# EAGLE design LoRa ST v2.0 (EAGLE 7.5.0)

## Sheet 1 of 2
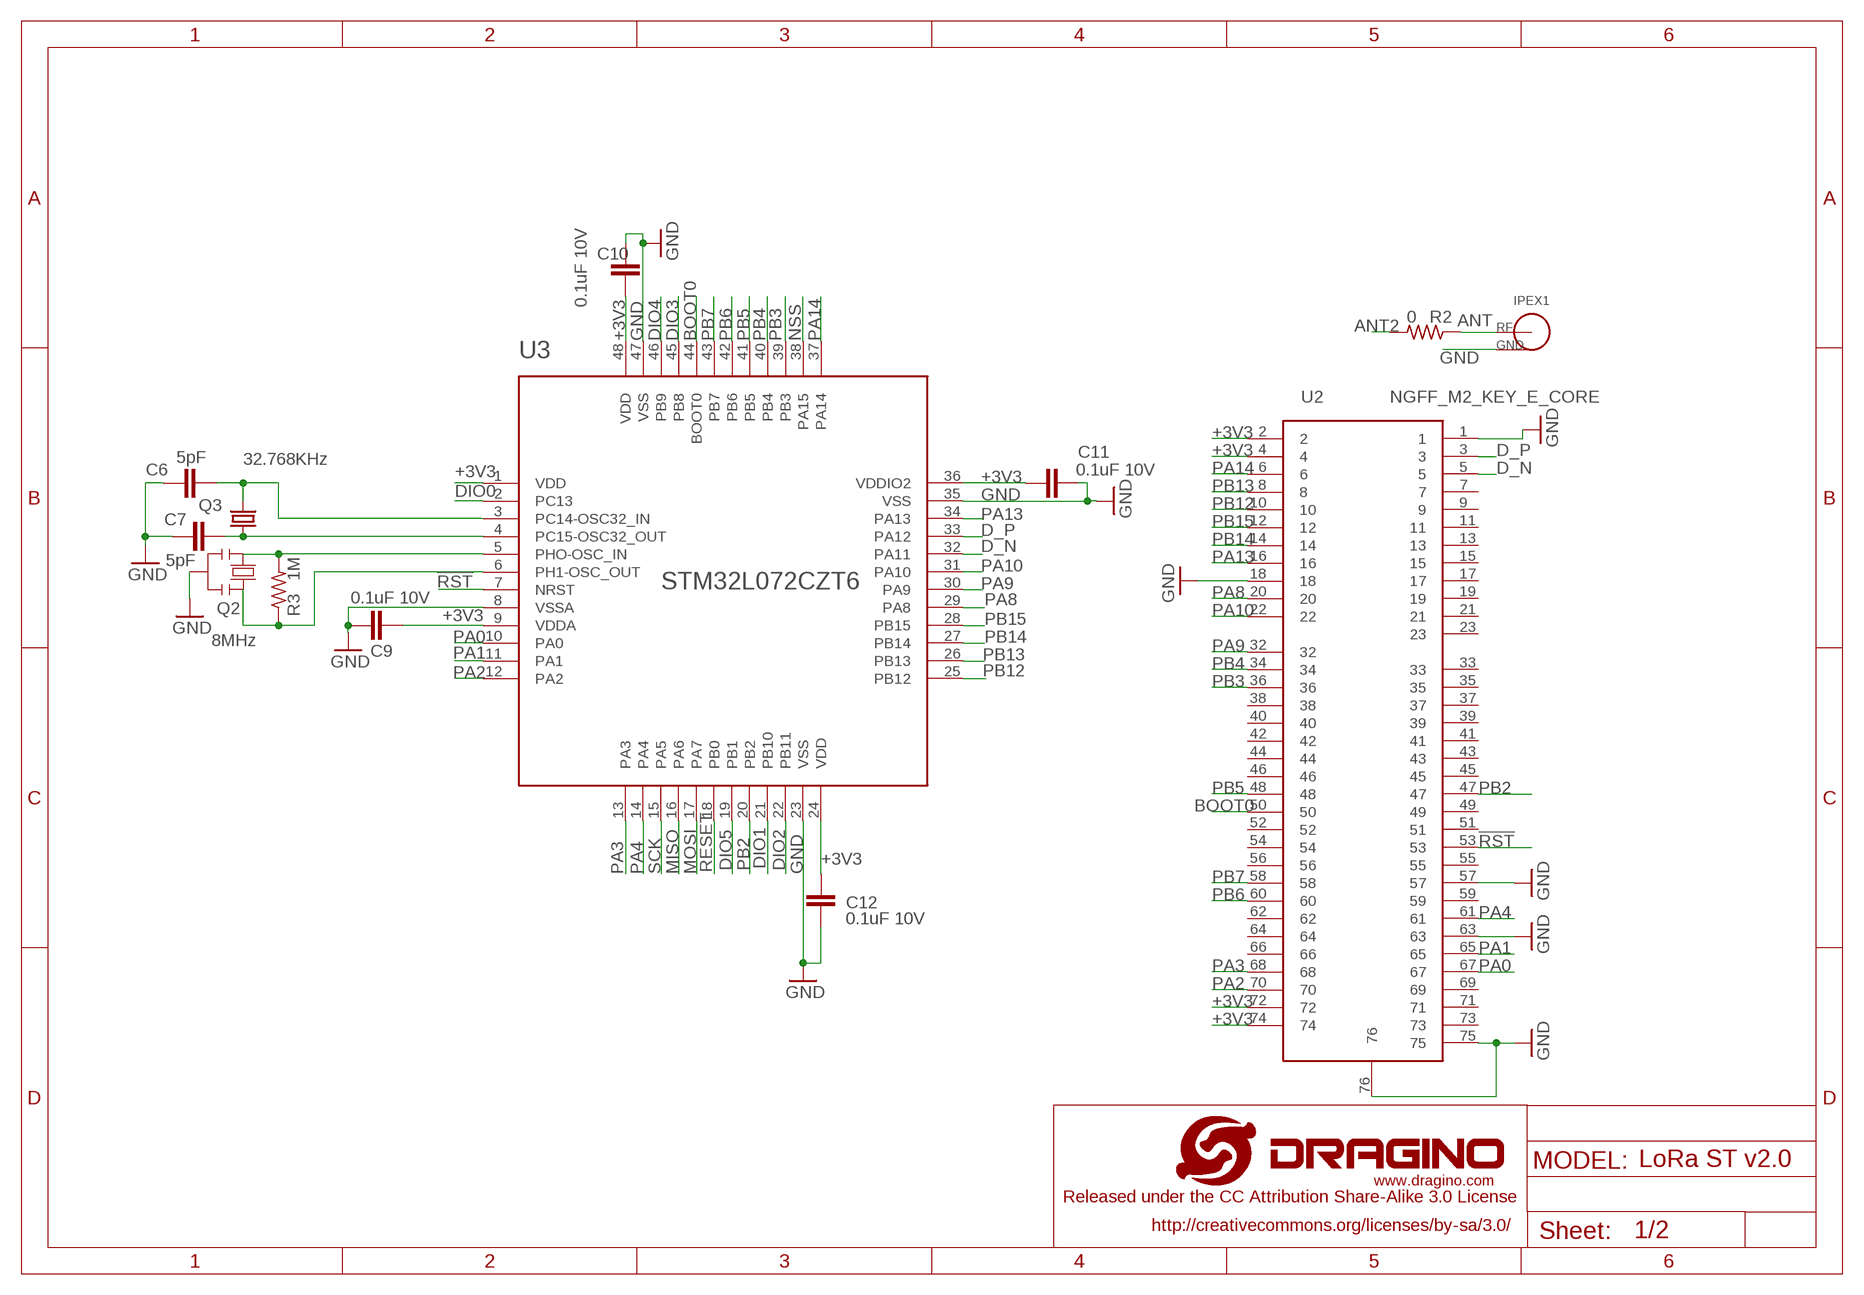
[diagram p0: schematic, sheet 1]

### Parts
C6  5pF  C-EUC0402  [C0402]
C7  5pF  C-EUC0402  [C0402]
C9  0.1uF 10V  C-EUC0402  [C0402]
C10  0.1uF 10V  C-EUC0402  [C0402]
C11  0.1uF 10V  C-EUC0402  [C0402]
C12  0.1uF 10V  C-EUC0402  [C0402]
IPEX1  I-PEX4  [I-PEX4]
Q2  8MHz  RESONATORMU  [RESONATOR]
Q3  32.768KHz  SMD-2012_2P  [32.768K]
R2  0  R-US_R0402  [R0402]
R3  1M  R-US_R0402  [R0402]
U2  NGFF_M2_KEY_E_CORE  [LORA_ST_PCB]
U3  STM32L072CZT6  STM32L0XX  [LQFP48]
U$2  LOGO-NEW  [LOGO-SILK-NEW]

### Nets
!RST: U2.53 U3.7(NRST)
+3V3: C9.1 C10.1 C11.2 C12.2 U2.2 U2.4 U2.72 U2.74 U3.1(VDD) U3.9(VDDA) U3.24(VDD) U3.36(VDDIO2) U3.48(VDD) ; also sheet 2
ANT [2layer-50ohm]: IPEX1.SIG R2.1 ; also sheet 2
ANT2: R2.2
BOOT0: U2.50 U3.44(BOOT0)
D_N: U2.5 U3.32(PA11)
D_P: U2.3 U3.33(PA12)
DIO0: U3.2(PC13) ; also sheet 2
DIO1: U3.21(PB10) ; also sheet 2
DIO2: U3.22(PB11) ; also sheet 2
DIO3: U3.45(PB8) ; also sheet 2
DIO4: U3.46(PB9) ; also sheet 2
DIO5: U3.19(PB1) ; also sheet 2
GND: C6.1 C7.1 C9.2 C10.2 C11.1 C12.1 IPEX1.GND1(GND) IPEX1.GND2(GND) IPEX1.GND3(GND) Q2.2 U2.1 U2.18 U2.57 U2.63 U2.75 U2.76 U3.8(VSSA) U3.23(VSS) U3.35(VSS) U3.47(VSS) ; also sheet 2
MISO: U3.16(PA6) ; also sheet 2
MOSI: U3.17(PA7) ; also sheet 2
N$4: Q2.1 R3.2 U3.5(PHO-OSC_IN)
N$5: Q2.3 R3.1 U3.6(PH1-OSC_OUT)
N$6: C7.2 Q3.3 U3.4(PC15-OSC32_OUT)
N$7: C6.2 Q3.4 U3.3(PC14-OSC32_IN)
NSS: U3.38(PA15) ; also sheet 2
PA0: U2.67 U3.10(PA0)
PA1: U2.65 U3.11(PA1)
PA2: U2.70 U3.12(PA2)
PA3: U2.68 U3.13(PA3)
PA4: U2.61 U3.14(PA4)
PA8: U2.20 U3.29(PA8)
PA9: U2.32 U3.30(PA9)
PA10: U2.22 U3.31(PA10)
PA13: U2.16 U3.34(PA13)
PA14: U2.6 U3.37(PA14)
PB2: U2.47 U3.20(PB2)
PB3: U2.36 U3.39(PB3)
PB4: U2.34 U3.40(PB4)
PB5: U2.48 U3.41(PB5)
PB6: U2.60 U3.42(PB6)
PB7: U2.58 U3.43(PB7)
PB12: U2.10 U3.25(PB12)
PB13: U2.8 U3.26(PB13)
PB14: U2.14 U3.27(PB14)
PB15: U2.12 U3.28(PB15)
RESET: U3.18(PB0) ; also sheet 2
SCK: U3.15(PA5) ; also sheet 2
Unconnected: U2.7 U2.9 U2.11 U2.13 U2.15 U2.17 U2.19 U2.21 U2.23 U2.33 U2.35 U2.37 U2.38 U2.39 U2.40 U2.41 U2.42 U2.43 U2.44 U2.45 U2.46 U2.49 U2.51 U2.52 U2.54 U2.55 U2.56 U2.59 U2.62 U2.64 U2.66 U2.69 U2.71 U2.73

## Sheet 2 of 2
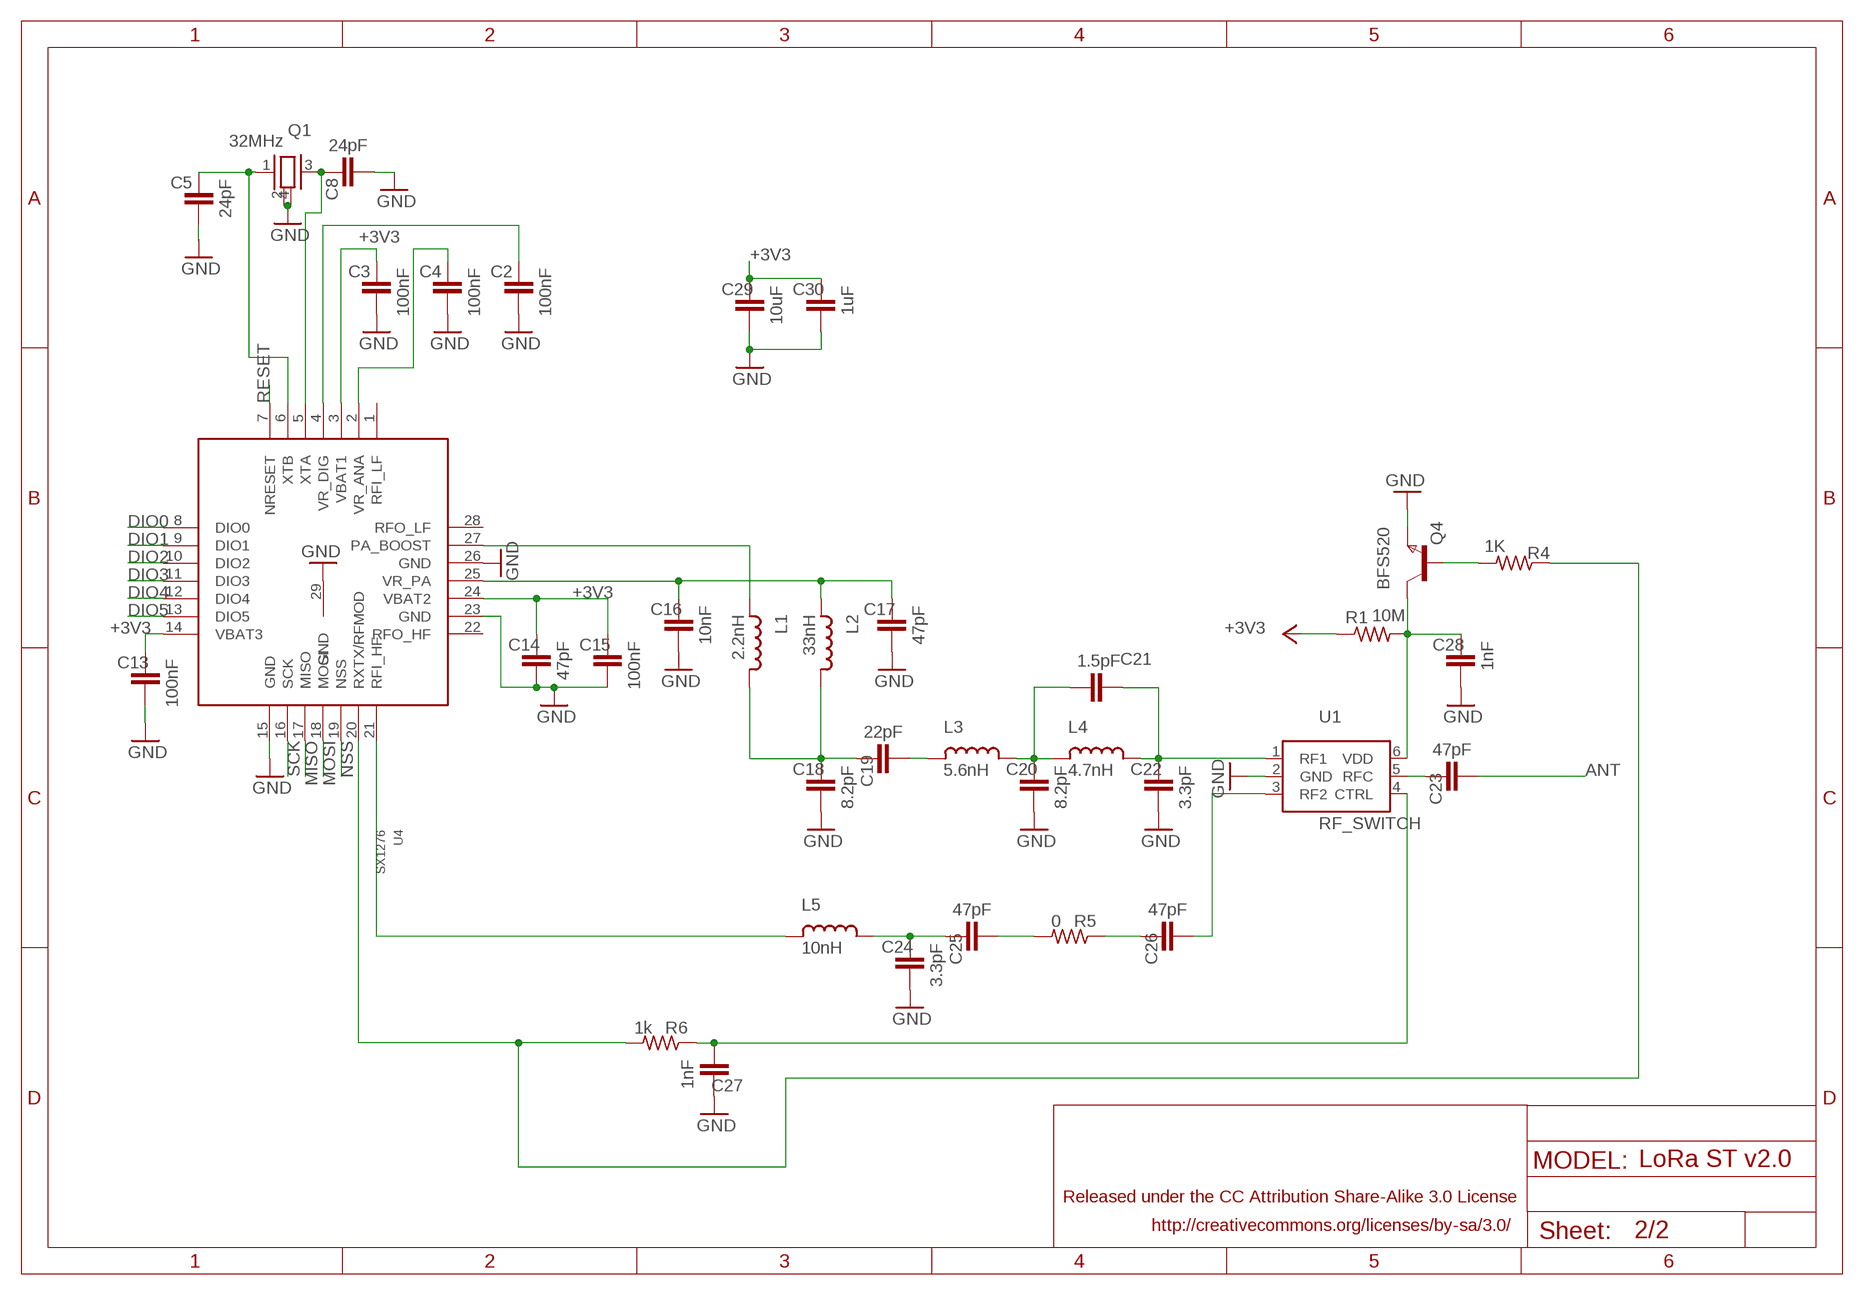
[diagram p1: schematic, sheet 2]

### Parts
C2  100nF  C-EUC0402  [C0402]
C3  100nF  C-EUC0402  [C0402]
C4  100nF  C-EUC0402  [C0402]
C5  24pF  C-EUC0402  [C0402]
C8  24pF  C-EUC0402  [C0402]
C13  100nF  C-EUC0402  [C0402]
C14  47pF  C-EUC0402  [C0402]
C15  100nF  C-EUC0402  [C0402]
C16  10nF  C-EUC0402  [C0402]
C17  47pF  C-EUC0402  [C0402]
C18  8.2pF  C-EUC0402  [C0402]
C19  22pF  C-EUC0402  [C0402]
C20  8.2pF  C-EUC0402  [C0402]
C21  1.5pF  C-EUC0402  [C0402]
C22  3.3pF  C-EUC0402  [C0402]
C23  47pF  C-EUC0402  [C0402]
C24  3.3pF  C-EUC0402  [C0402]
C25  47pF  C-EUC0402  [C0402]
C26  47pF  C-EUC0402  [C0402]
C27  1nF  C-EUC0402  [C0402]
C28  1nF  C-EUC0402  [C0402]
C29  10uF  C-EUC0805  [C0805]
C30  1uF  C-EUC0805  [C0805]
L1  2.2nH  I-EU0402  [I-0402]
L2  33nH  I-EU0402  [I-0402]
L3  5.6nH  I-EU0402  [I-0402]
L4  4.7nH  I-EU0402  [I-0402]
L5  10nH  I-EU0402  [I-0402]
Q1  32MHz  Q  [SMD-3225_4P]
Q4  BFS520  NPNSOT323  [SOT323]
R1  10M  R-US_R0402  [R0402]
R4  1K  R-US_R0402  [R0402]
R5  0  R-US_R0402  [R0402]
R6  1k  R-US_R0402  [R0402]
U1  RF_SWITCH  [SC70-6]
U4  SX1276  [VQFN28_6X6MM]

### Nets
+3V3: C3.2 C13.2 C14.2 C15.2 C29.2 C30.2 R1.1 U4.3(VBAT1) U4.14(VBAT3) U4.24(VBAT2) ; also sheet 1
ANT [2layer-50ohm]: C23.1 ; also sheet 1
DIO0: U4.8(DIO0) ; also sheet 1
DIO1: U4.9(DIO1) ; also sheet 1
DIO2: U4.10(DIO2) ; also sheet 1
DIO3: U4.11(DIO3) ; also sheet 1
DIO4: U4.12(DIO4) ; also sheet 1
DIO5: U4.13(DIO5) ; also sheet 1
GND: C2.1 C3.1 C4.1 C5.1 C8.1 C13.1 C14.1 C15.1 C16.1 C17.1 C18.1 C20.1 C22.1 C24.1 C27.2 C28.1 C29.1 C30.1 Q1.2 Q1.4 Q4.3(E) U1.2(GND) U4.15(GND) U4.23(GND) U4.26(GND) U4.29(GND) ; also sheet 1
MISO: U4.17(MISO) ; also sheet 1
MOSI: U4.18(MOSI) ; also sheet 1
N$19: C5.2 Q1.1 U4.6(XTB)
N$21: C2.2 U4.4(VR_DIG)
N$24: C4.2 U4.2(VR_ANA)
N$25: C8.2 Q1.3 U4.5(XTA)
N$26: Q4.2(B) R4.2
N$27: C16.2 C17.2 L2.1 U4.25(VR_PA)
N$28: C26.1 U1.3(RF2)
N$29: L1.1 U4.27(PA_BOOST)
N$30: C26.2 R5.1
N$31: C18.2 C19.2 L1.2 L2.2
N$32: C19.1 L3.1
N$33: C20.2 C21.2 L3.2 L4.1
N$35: C21.1 C22.2 L4.2 U1.1(RF1)
N$36: C23.2 U1.5(RFC)
N$37: C28.2 Q4.1(C) R1.2 U1.6(VDD)
N$38: C25.1 R5.2
N$39: C24.2 C25.2 L5.2
N$40: L5.1 U4.21(RFI_HF)
N$41: C27.1 R6.1 U1.4(CTRL)
N$42: R4.1 R6.2 U4.20(RXTX/RFMOD)
NSS: U4.19(NSS) ; also sheet 1
RESET: U4.7(NRESET) ; also sheet 1
SCK: U4.16(SCK) ; also sheet 1
Unconnected: U4.1(RFI_LF) U4.22(RFO_HF) U4.28(RFO_LF)

## Library data of the parts
C2-C30 = dragino-passive:C-EU: CAPACITOR, European symbol
IPEX1 = dragino-passive:I-PEX: I-PEX, U.F.L connector
L1-L5 = dragino:I-EU0402
Q1 = dragino:Q
Q2 = SmartPrj:RESONATOR
Q3 = crystal:SMD-2012_2P: kHz RANGE CRYSTAL UNIT SMD Source: MC-306_405_406_E07X.PDF Homepage <http://www.epsontoyocom.co.jp>
Q4 = zetex:NPNSOT323: NPN TRANSISTOR; MPN: DSS4160U-7; OC_FARNELL: 1710696; OC_NEWARK: 25R4558
R1-R6 = dragino:R-US_: RESISTOR, American symbol
U1 = dragino:RF_SWITCH
U2 = dragino:NGFF_M2_KEY_E
U3 = dragino:STM32L0XX
U4 = dragino:SX1276
U$2 = dragino:LOGO-NEW

## Net classes
0 default: width 0.203 mm, clearance 0.203 mm
1 vcc: width 0.254 mm
2 gnd: width 0.305 mm, drill 0.254 mm, clearance 0.203 mm
3 2layer-50ohm: width 0.305 mm, clearance 0.203 mm

## Board
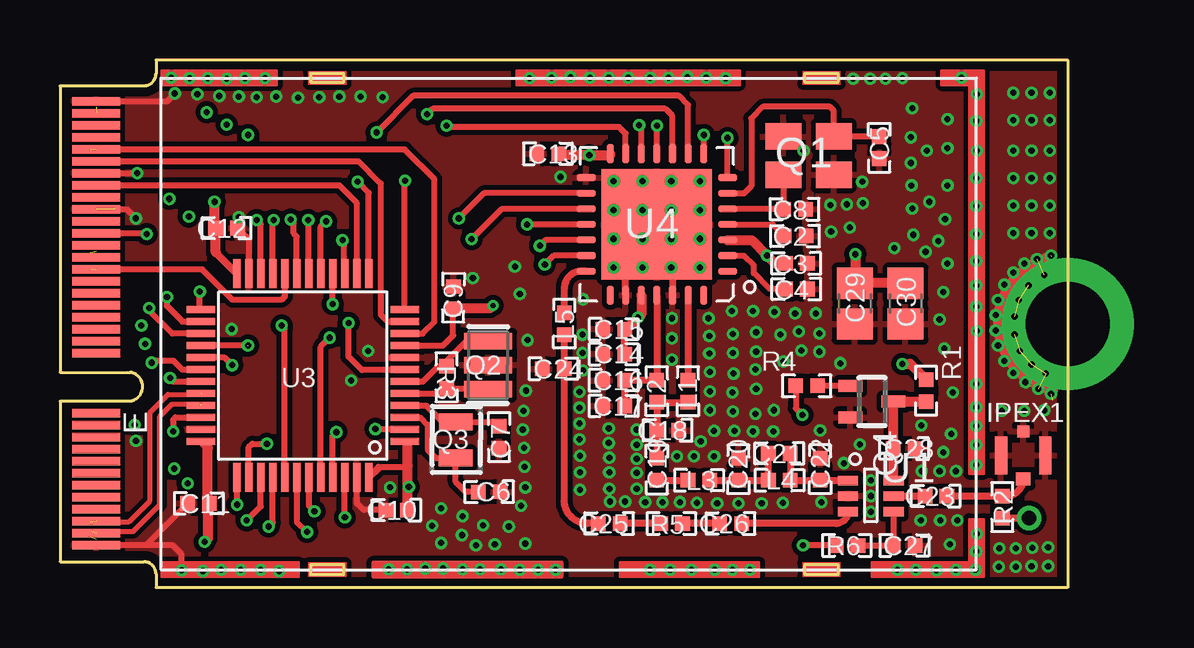
[diagram p2: board, top side]
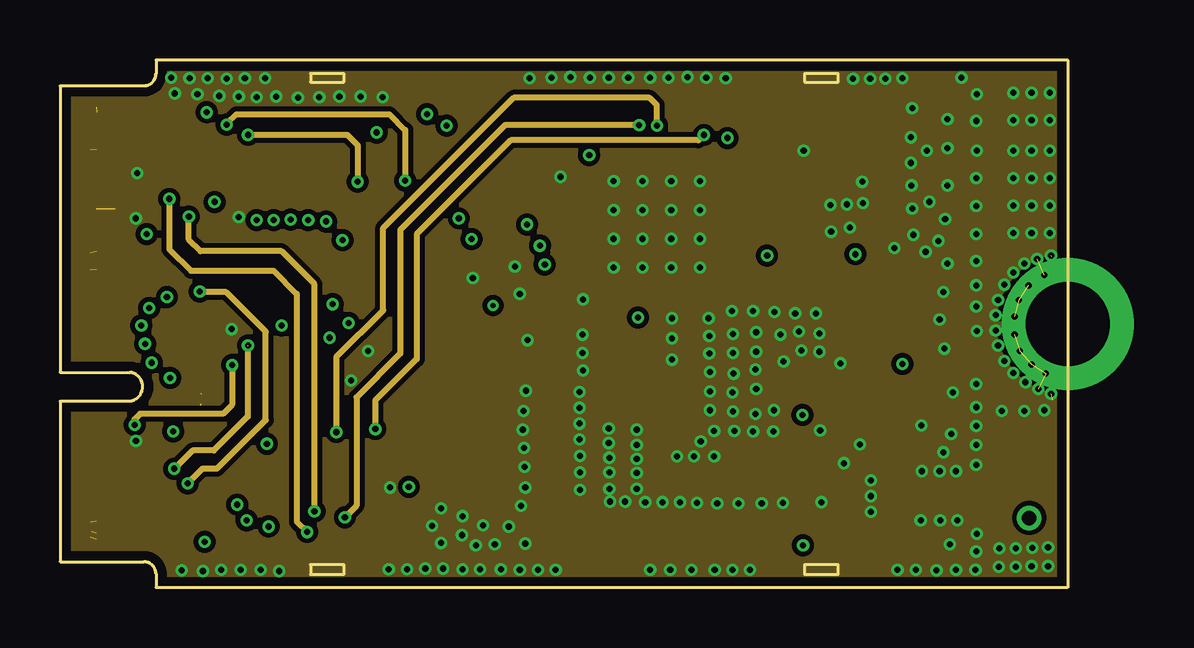
[diagram p3: board, inner layer Route2]
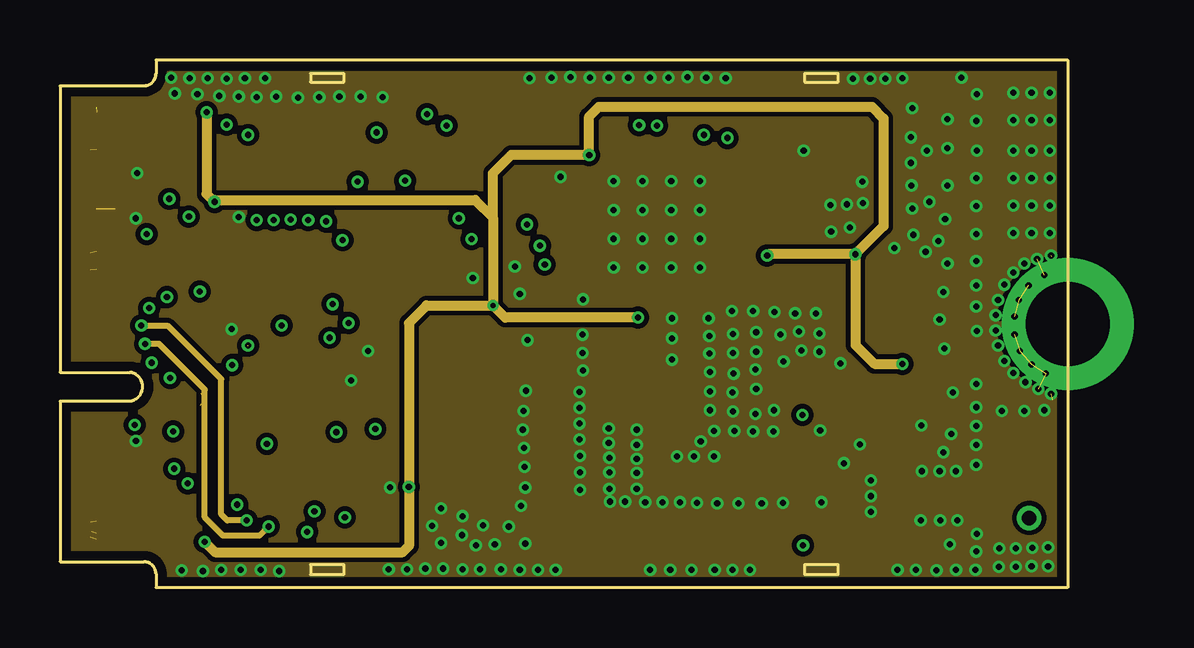
[diagram p4: board, inner layer Route15]
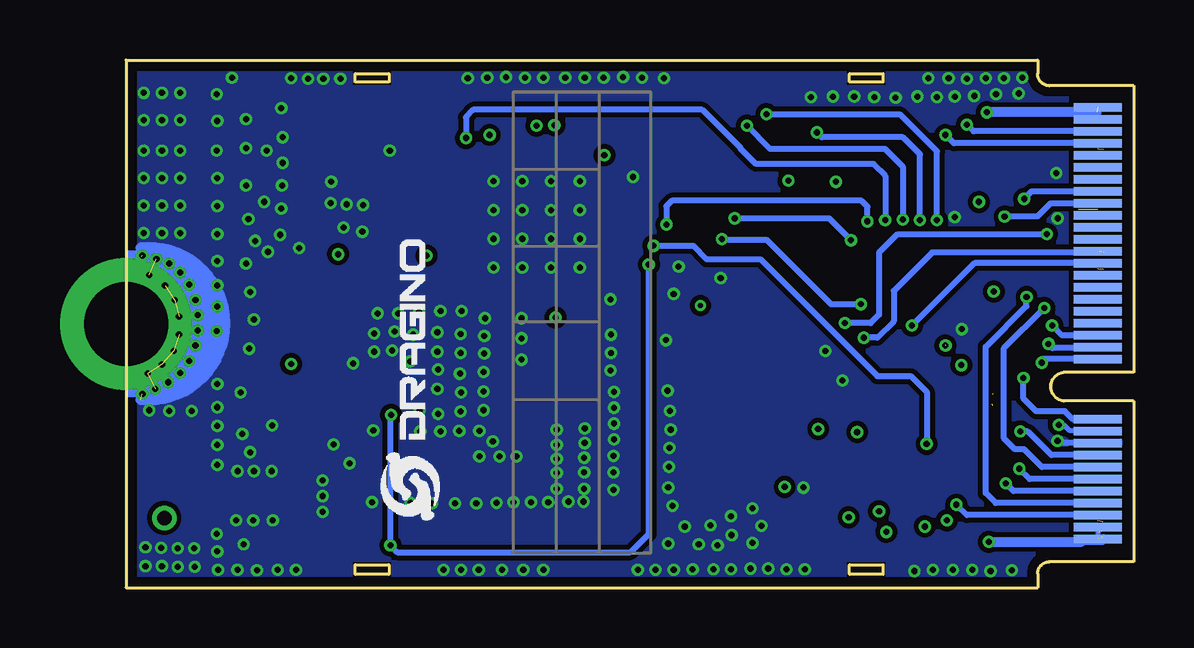
[diagram p5: board, bottom side, seen from below]

Size 42 x 22 mm. Coordinates in mm from the lower left corner, seen from the top.
Copper layers (1*2+15*16): Top 0.035mm / dielectric 0.2mm / Route2 0.035559375mm / dielectric 0.2mm / Route15 0.035559375mm / dielectric 0.2mm / Bottom 0.035mm
Design rules "default *": minimum track width 6mil, minimum drill 8mil, track to track 6mil, track to pad 6mil, pad to pad 6mil, via to via 6mil, smd to smd 6mil, copper to edge 15mil, drill to drill 8mil, minimum pad ring 5mil, minimum via ring 5mil, stop-mask expansion 4mil, vias tented up to drill 30mil, thermal gap 8mil
tRestrict: 4 lines

### Footprints (pad centres in the part's own frame; a part is rotated, then mirrored left to right if it is on the bottom)
C0402 = smd 0.61 x 0.61: 1 -0.457,0; 2 0.457,0
C0805 = smd 1.3 x 1.5: 1 -0.85,0; 2 0.85,0
I-PEX4 = smd 0.508 x 1.58: GND1 -0.924,0; GND3 0.924,0 | smd 0.5 x 0.5: GND2 0,1 | smd 0.6 x 0.55: SIG 0,-0.975
I-0402 = smd 0.61 x 0.61: 1 -0.457,0; 2 0.457,0
SMD-3225_4P = smd 1.5 x 1.1: 1 -1.05,-0.8; 2 1.05,-0.8; 3 1.05,0.8; 4 -1.05,0.8
RESONATOR = smd 0.7 x 2: 1 -1,0; 2 0,0; 3 1,0
32.768K = smd 0.7 x 1.4: 3 0.78,0.03; 4 -0.72,0.03
SOT323 = smd 0.5 x 1: 1 0,0.9; 2 -0.65,-0.9; 3 0.65,-0.9
R0402 = smd 0.61 x 0.61: 1 -0.457,0; 2 0.457,0
SC70-6 = smd 0.85 x 0.4: 1 -0.95,0.65; 2 -0.95,0; 3 -0.95,-0.65; 4 0.95,-0.65; 5 0.95,0; 6 0.95,0.65
LORA_ST_PCB = smd 0.35 x 2: 1 20.225,-40.5; 3 19.725,-40.5; 5 19.225,-40.5; 7 18.725,-40.5; 9 18.225,-40.5; 11 17.725,-40.5; 13 17.227,-40.5; 15 16.725,-40.5; 17 16.225,-40.5; 19 15.725,-40.5; 21 15.225,-40.5; 23 14.725,-40.5; 33 12.225,-40.5; 35 11.725,-40.5; 37 11.225,-40.5; 39 10.725,-40.5; 41 10.225,-40.5; 43 9.725,-40.5; 45 9.225,-40.5; 47 8.725,-40.5; 49 8.225,-40.5; 51 7.725,-40.5; 53 7.225,-40.5; 55 6.725,-40.5; 57 6.225,-40.5; 59 5.725,-40.5; 61 5.225,-40.5; 63 4.725,-40.5; 65 4.225,-40.5; 67 3.725,-40.5; 69 3.225,-40.5; 71 2.725,-40.5; 73 2.225,-40.5; 75 1.725,-40.5 | smd 0.35 x 2 bottom: 2 19.975,-40.5; 4 19.475,-40.5; 6 18.975,-40.5; 8 18.475,-40.5; 10 17.975,-40.5; 12 17.475,-40.5; 14 16.975,-40.5; 16 16.475,-40.5; 18 15.975,-40.5; 20 15.475,-40.5; 22 14.975,-40.5; 32 12.475,-40.5; 34 11.975,-40.5; 36 11.475,-40.5; 38 10.975,-40.5; 40 10.475,-40.5; 42 9.975,-40.5; 44 9.475,-40.5; 46 8.975,-40.5; 48 8.475,-40.5; 50 7.975,-40.5; 52 7.475,-40.5; 54 6.975,-40.5; 56 6.475,-40.5; 58 5.975,-40.5; 60 5.475,-40.5; 62 4.975,-40.5; 64 4.475,-40.5; 66 3.975,-40.5; 68 3.475,-40.5; 70 2.975,-40.5; 72 2.475,-40.5; 74 1.975,-40.5 | drill 3.5 pad 5.5: 76 11,0
LQFP48 = smd 1.2 x 0.3: 1 -4.25,2.75; 2 -4.25,2.25; 3 -4.25,1.75; 4 -4.25,1.25; 5 -4.25,0.75; 6 -4.25,0.25; 7 -4.25,-0.25; 8 -4.25,-0.75; 9 -4.25,-1.25; 10 -4.25,-1.75; 11 -4.25,-2.25; 12 -4.25,-2.75; 25 4.25,-2.75; 26 4.25,-2.25; 27 4.25,-1.75; 28 4.25,-1.25; 29 4.25,-0.75; 30 4.25,-0.25; 31 4.25,0.25; 32 4.25,0.75; 33 4.25,1.25; 34 4.25,1.75; 35 4.25,2.25; 36 4.25,2.75 | smd 0.3 x 1.2: 13 -2.75,-4.25; 14 -2.25,-4.25; 15 -1.75,-4.25; 16 -1.25,-4.25; 17 -0.75,-4.25; 18 -0.25,-4.25; 19 0.25,-4.25; 20 0.75,-4.25; 21 1.25,-4.25; 22 1.75,-4.25; 23 2.25,-4.25; 24 2.75,-4.25; 37 2.75,4.25; 38 2.25,4.25; 39 1.75,4.25; 40 1.25,4.25; 41 0.75,4.25; 42 0.25,4.25; 43 -0.25,4.25; 44 -0.75,4.25; 45 -1.25,4.25; 46 -1.75,4.25; 47 -2.25,4.25; 48 -2.75,4.25
VQFN28_6X6MM = smd 0.8 x 0.3: 1 -2.95,1.95; 2 -2.95,1.3; 3 -2.95,0.65; 4 -2.95,0; 5 -2.95,-0.65; 6 -2.95,-1.3; 7 -2.95,-1.95; 15 2.95,-1.95; 16 2.95,-1.3; 17 2.95,-0.65; 18 2.95,0; 19 2.95,0.65; 20 2.95,1.3; 21 2.95,1.95 | smd 0.3 x 0.8: 8 -1.95,-2.95; 9 -1.3,-2.95; 10 -0.65,-2.95; 11 0,-2.95; 12 0.65,-2.95; 13 1.3,-2.95; 14 1.95,-2.95; 22 1.95,2.95; 23 1.3,2.95; 24 0.65,2.95; 25 0,2.95; 26 -0.65,2.95; 27 -1.3,2.95; 28 -1.95,2.95 | smd 4.6 x 4.6: 29 0,0

### Placement (x,y rotation side)
C2  30.65,14.66 180 top
C3  30.7,13.52 180 top
C4  30.7,12.45 180 top
C5  34.15,18.34 90 top
C6  17.9,3.99 180.6 top
C7  18.3,6.28 90 top
C8  30.62,15.78 180 top
C9  16.4,12.09 89.2 top
C10  14.03,3.23 180 top
C11  5.78,3.51 0 top
C12  6.95,14.99 180 top
C13  20.33,18.09 0 top
C14  23.08,9.73 0 top
C15  23.08,10.77 0 top
C16  23.08,8.64 0 top
C17  23.08,7.57 0 top
C18  25.34,6.56 180 top
C19  24.88,4.93 90 top
C20  28.28,4.93 270 top
C21  29.99,5.59 180 top
C22  31.69,4.93 270 top
C23  36.51,3.81 180 top
C24  20.56,9.12 0 top
C25  22.9,2.67 180 top
C26  27.95,2.67 180 top
C27  35.19,1.76 0 top
C28  35.19,5.79 180 top
C29  33.14,11.84 90 top
C30  35.24,11.84 90 top
IPEX1  40.15,5.5 0 top
L1  26.18,8.18 270 top
L2  24.88,8.18 270 top
L3  26.63,4.47 0 top
L4  29.99,4.47 0 top
L5  21.02,11 270 top
Q1  31.2,18.01 180 top
Q2  17.84,9.27 89.7 top
Q3  16.52,6.12 89.8 top
Q4  33.85,7.75 270 top
R1  36.11,8.21 270 top
R2  39.28,3.36 270 top
R3  16.12,8.77 270.1 top
R4  31.13,8.41 0 top
R5  25.49,2.67 180 top
R6  32.81,1.76 180 top
U1  33.8,3.81 0 top
U2  42,22 270 top
U3  10.12,8.84 180 top
U4  24.88,15.14 180 top
U$1  [LORA_ST]  38.2,21.25 180 top
U$2  28.92,2.8 90 bottom

### Tracks (layer width: path | path; a pad name or v marks a point on that pad's centre or on a via)
!RST  (via drill 0.25 pad 0.25)
  Top 0.254: U3.7 14.37,9.11 14.33,9.07 12.59,9.07 12.03,9.63 v12.03,11.03 | U2.53 3.62,14.78 v3.62,14.74
  Bottom 0.254: v3.62,14.74 9.84,14.74 10.61,13.97 10.61,11.38 10.96,11.03 v12.03,11.03
+3V3  (via drill 0.2 pad 0.25, 0.25, 0.25 pad 0.25)  (2 unrouted)
  Top 0.254: 6.54,14.94 C12.2 6.44,15.04 | 6.16,3.59 C11.2 | v14.54,4.2 14.49,4.2 | 14.49,5.08 14.44,5.04 13.27,5.04 13.27,4.99 | 16.37,11.62 C9.1 16.39,10.51 15.96,10.09 U3.9 | U3.1 14.41,6.09 14.49,6.01 | U4.3
  Top 0.3: C14.2 C15.2
  Top 0.305: U3.36 6.16,5.8 | U3.24 6.49,13.97 | 13.27,4.99 U3.48
  Top 0.406: C10.1 14.49,4.2 14.49,5.08 14.49,6.01 | v6.03,1.91 6.16,2.04 6.16,3.51 | 6.16,3.51 6.16,5.8 | C11.2 6.16,3.51 | 6.49,13.97 C12.2 | 6.44,15.04 v6.44,16.08 | C13.2 20.84,18.04 v22.06,18.04 22.93,18.04 U4.14 | v18.05,11.76 17.92,11.64 C9.1 | U4.3 28.84,14.48 v29.48,13.85 29.81,13.52 C3.2 | C15.2 23.61,10.77 v24.09,11.26 24.23,11.39 U4.24 | C30.2 C29.2 33.16,12.71 v33.16,13.9 | v35.12,9.32 35.45,9.32 R1.1
  Route15 0.406: v6.03,1.91 6.47,1.48 14.29,1.48 14.54,1.73 v14.54,4.2 14.54,11.03 15.28,11.76 v18.05,11.76 | v6.11,19.82 6.11,16.41 v6.44,16.08 6.44,16.16 17.31,16.16 18.05,15.42 | 18.05,15.42 v18.05,11.76 | 18.05,15.42 18.05,17.28 18.81,18.04 v22.06,18.04 22.06,19.64 22.47,20.04 33.85,20.04 34.33,19.56 34.33,15.07 v33.16,13.9 | v24.09,11.26 18.56,11.26 v18.05,11.76 | v33.16,13.9 29.53,13.9 v29.48,13.85 | v33.16,13.9 33.16,10.11 33.95,9.32 v35.12,9.32
  Bottom 0.203: U2.72 U2.74 | U2.4 U2.2
  Bottom 0.254: 2.17,1.91 1.26,1.91 | 1.25,1.91 1.26,1.91 | 1.26,1.91 1.26,2.11 1.23,2.11
  Bottom 0.406: v6.03,1.91 2.17,1.91 | 1.54,19.82 v6.11,19.82
ANT
  Top 0.3: 39.45,3.82 arc90 IPEX1.SIG | C23.1 R2.1
  Top 0.406: R2.1 39.28,3.82 39.45,3.82
ANT2  (via drill 0.6 pad 1.02)
  Top 0.3: R2.2 v40.4,2.9
BOOT0  (via drill 0.25 pad 0.25)  (1 unrouted)
  Top 0.254: U3.44 10.87,10.05 v11.24,10.42
  Bottom 0.254: 1.25,13.97 8.4,13.97 10,12.37 10,11.1 10.68,10.42 v11.24,10.42
D_N  (2 unrouted)
  Top 0.203: 1.28,2.75 2.88,2.75 3.75,3.62 3.75,7.3 4.51,8.05 5.88,8.05
D_P  (2 unrouted)
  Top 0.203: 1.31,2.34 3.04,2.34 4.16,3.46 4.16,7.13 4.68,7.65 5.88,7.65
DIO0  (via drill 0.25, 0.25 pad 0.25)
  Top 0.254: v13.15,6.61 14.36,6.61 U3.2 | U4.8 v26.84,18.88
  Route2 0.254: v26.84,18.88 26.61,18.65 18.78,18.65 14.87,14.74 14.87,9.53 13.15,7.8 v13.15,6.61
DIO1  (via drill 0.25)
  Top 0.254: U3.21 8.87,15.29 v8.9,15.32 | U4.9 26.18,20.12 25.8,20.5 14.72,20.5 v13.2,18.98
  Bottom 0.254: v8.9,15.32 8.9,18.06 9.62,18.77 12.99,18.77 v13.2,18.98
DIO2  (via drill 0.25)
  Top 0.254: U3.22 8.37,15.14 v8.19,15.32 | U4.10 25.53,19.67 25.24,19.97 15.53,19.97 v15.3,19.74
  Bottom 0.254: v8.19,15.32 8.19,18.19 9.74,19.74 v15.3,19.74
DIO3  (via drill 0.25)
  Top 0.254: U3.45 11.37,6.33 v11.52,6.48 | U4.11 v24.88,19.26
  Route2 0.254: v24.88,19.26 24.88,20.12 24.58,20.43 18.91,20.43 13.48,14.99 13.48,11.56 11.52,9.61 v11.52,6.48
DIO4  (via drill 0.25)
  Top 0.254: U3.46 | U3.46 | v11.88,2.93 v11.87,2.93 U3.46 | U4.12 24.23,19.2 v24.14,19.28
  Route2 0.254: v24.14,19.28 18.56,19.28 14.19,14.91 14.19,9.76 12.36,7.93 12.36,3.41 v11.88,2.93
DIO5  (via drill 0.25)
  Top 0.254: U3.19 9.87,14.63 9.74,14.76 9.74,15.22 v9.62,15.34 | U4.13 23.58,18.93 23.31,19.21 16.17,19.21 v16.12,19.26
  Bottom 0.254: v9.62,15.34 9.62,17.55 10.35,18.29 15.15,18.29 v16.12,19.26
GND  (via drill 0.25)  (10 unrouted)
  Top 0.254: 5.27,3.51 C11.1 3.59,1.77 | C10.2 12.66,3.23 12.38,3.51 12.38,4.58 U3.47 | C12.1 7.87,14.52 U3.23 | U2.1 3.59,1.77 | 3.59,1.77 4.67,1.77 5.04,1.4 5.04,0.74 v5.07,0.71 | U3.8 13.68,9.58 | U2.63 v3.21,17.27 v3.21,17.28 | U2.75 4.46,20.27 v4.79,20.6 | Q1.2 30.41,18.81 v31,18.21 | 2.3,15.78 2.78,15.78 v3.16,15.4
  Top 0.3: U4.23 23.58,13.84 v24.28,14.54 | U4.29 25.53,14.49 U4.26
  Top 0.406: 41.39,8.23 arc-156 41.34,13.8
  Bottom 0.254: U2.18 3.06,6.03
  Bottom 0.406: 41.39,7.83 arc-192 41.39,14.18
  other vias: 19.22,3.41 13.76,4.17 16.75,2.19 40.25,8.56 39.74,8.94 39.36,9.45 39.1,10.09 39,10.72 39,11.36 39.1,11.99 39.36,12.63 39.74,13.14 40.2,13.52 38.22,10.7 38.19,11.71 38.19,12.6 38.19,5.11 38.19,5.95 15.89,1.86 7.15,10.77 41.26,14.79 40.5,14.79 39.74,14.79 38.19,13.62 41.26,15.93 40.5,15.93 39.74,15.93 38.19,15.9 41.26,17.07 40.5,17.07 39.74,17.07 38.19,17.07 41.26,18.22 40.5,18.22 39.74,18.22 38.22,18.22 41.26,19.49 40.5,19.49 39.74,19.49 38.19,19.46 41.26,20.63 40.5,20.63 39.74,20.63 38.22,20.58 37.58,21.26 38.19,8.49 26.94,21.26 25.36,21.26 24.6,21.26 7.71,21.24 6.95,21.21 6.16,21.24 5.4,21.24 37.35,0.74 36.54,0.71 35.68,0.74 34.91,0.74 5.96,0.69 28.77,0.74 28.03,0.74 27.29,0.74 26.33,0.74 25.44,0.74 24.6,0.74 20.66,0.74 19.93,0.74 19.17,0.74 18.38,0.77 17.51,0.77 16.78,0.77 15.96,0.79 15.23,0.79 14.47,0.77 13.7,0.77 9.13,0.69 8.37,0.74 7.53,0.74 6.72,0.74 38.19,7.52 3.17,6.11 38.19,6.73 12.84,9.86 7.46,15.45 8.55,21.24 8.19,20.45 7.46,20.48 6.64,20.5 5.73,20.58 35.12,21.24 34.41,21.21 33.77,21.21 33.06,21.21 27.75,21.24 22.87,21.26 22.09,21.26 21.27,21.29 20.49,21.26 40.78,8.28 41.31,8.08 41.31,13.85 40.73,13.69 41.09,8.92 40.5,9.3 40.02,9.86 39.79,10.54 39.79,11.31 39.97,11.99 40.37,12.6 41.03,13.03 38.16,0.74 38.19,1.5 38.22,2.24 41.03,7.39 40.2,7.37 39.26,7.37 41.19,1.68 40.53,1.65 39.84,1.63 39.16,1.63 41.19,0.89 40.5,0.89 39.84,0.87 39.13,0.87 25.52,11.23 25.52,9.5 25.52,10.39 33.8,3.81 28.28,3.51 27.39,3.51 26.56,3.53 25.85,3.56 25.11,3.56 24.4,3.56 23.56,3.59 22.92,3.59 21.68,4.07 21.65,8.16 21.81,9.05 21.78,9.78 21.78,10.54 21.81,12.02 20.87,17.12 33.8,4.47 33.8,3.15 21.68,4.8 21.68,5.49 21.65,6.18 21.65,6.84 21.65,7.5 24.04,6.58 24.04,5.95 24.04,5.36 24.04,4.78 24.04,4.12 22.9,4.12 22.9,4.8 22.9,5.41 22.87,6.02 22.87,6.63 29.25,3.51 30.14,3.53 29.02,8.28 31.74,3.56 37.4,2.8 36.69,2.8 35.88,2.8 35.93,4.86 36.67,4.86 37.35,4.86 25.48,15.74 25.72,5.46 26.43,5.46 27.27,5.46 32.68,5.19 17.64,2.59 15.89,3.31 16.78,2.98 18.71,2.54 19.39,1.83 18.12,1.81 17.34,1.76 15.51,2.57 27.27,6.53 28.11,6.53 28.89,6.51 29.73,6.51 31.69,6.56 26.71,6.1 27.09,7.39 27.09,8.18 27.09,9 27.06,9.76 27.06,10.49 27.04,11.23 28,11.54 28.89,11.54 29.78,11.48 30.65,11.43 31.51,11.43 31.66,10.6 31.66,9.83 28.06,10.57 28.06,9.78 28.08,8.92 28.03,8.13 28.06,7.34 29,7.24 29,9.1 29.02,9.83 29.02,10.65 30.04,10.54 30.16,9.43 30.9,9.88 30.8,10.67 19.39,4.17 19.37,5.03 19.34,5.82 19.29,6.58 19.32,7.37 19.42,8.21 19.5,10.32 19.17,12.25 18.96,13.39 17.21,12.91 12.13,8.64 4.64,21.26 9.01,20.48 9.92,20.43 10.81,20.45 11.65,20.48 12.54,20.48 13.45,20.45 19.57,21.24 32.12,15.95 32.81,15.98 33.47,16.03 33.44,16.92 32.14,14.84 32.93,15.02 36.13,18.22 36.23,16.08 36.08,14 37,13.52 23.69,21.26 26.15,21.29 35.52,19.99 35.47,18.77 35.47,17.71 35.5,16.77 35.52,15.8 35.57,14.71 34.79,14.15 36.62,14.46 36.89,15.37 37,16.77 37,18.32 37,19.54 37.15,6.4 36.87,9.96 36.67,11.18 36.82,12.32 25.48,14.54 26.68,14.54 26.68,13.34 25.48,13.34 24.28,13.34 23.08,13.34 23.08,14.54 23.08,15.74 23.08,16.94 24.28,16.94 25.48,16.94 26.68,16.94 26.68,15.74 24.28,15.74 37.1,1.81 29.76,7.39 33.34,5.97 35.9,6.76 36.82,5.64 37.22,8.13 38.19,14.74 32.53,9.35
  pour Route15: 41.97,0 4,0 4,0.59 arc90 3.49,1.1 -0.01,1.1 -0.01,7.8 2.83,7.8 arc90 3.42,8.39 3.42,8.46 arc90 2.91,8.97 0.04,8.97 0.04,20.98 3.65,20.98 arc90 4,21.34 4,21.97 41.97,21.97
  pour Bottom: 41.97,0 4,0 4,0.51 arc90 3.42,1.1 -0.01,1.1 -0.01,7.78 2.86,7.78 2.86,7.75 arc90 3.42,8.31 3.42,8.44 arc90 2.86,9 arc-1 0.06,9.02 0.06,20.91 3.44,20.91 arc90 4,21.47 4,21.97 41.97,21.97
  pour Top: 41.97,0 4,0 4,0.62 arc90 3.53,1.09 0.04,1.09 0.04,7.78 2.84,7.78 arc90 3.42,8.35 3.42,8.46 arc90 2.89,8.99 -0.05,8.99 -0.05,20.95 3.47,20.95 arc90 4.03,21.5 4.03,22.1 41.97,22.1
  pour Route2: 41.97,0 4,0 4,0.64 arc90 3.55,1.09 0.03,1.09 0.03,7.66 0.02,7.66 0.02,7.75 2.86,7.75 arc90 3.45,8.34 3.45,8.39 arc90 2.87,8.96 0.02,8.96 0.02,20.95 3.45,20.95 arc90 4.06,21.56 4.06,21.99 42.01,21.99 42.01,20.31 41.97,20.31
MISO  (via drill 0.25)
  Top 0.254: v17.16,14.53 18.4,15.78 21.88,15.78 21.9,15.79 U4.17 | v11.37,11.81 v11.37,11.82 U3.16
  Bottom 0.254: v17.16,14.53 17.11,14.48 17.08,14.51 15.3,14.51 12.61,11.81 v11.37,11.81
MOSI  (via drill 0.25)
  Top 0.254: U3.17 10.87,15.05 v11.09,15.27 | U4.18 v19.47,15.14
  Bottom 0.254: v11.09,15.27 11.09,15.88 11.34,16.13 19.24,16.13 19.47,15.9 v19.47,15.14
N$4
  Top 0.254: U3.5 15.9,8.09 arc90 R3.2 17.8,8.31 Q2.1
N$5
  Top 0.254: U3.6 15.13,8.59 15.76,9.22 R3.1 16.12,9.45 16.93,10.27 Q2.3
N$6
  Top 0.254: U3.4 15.26,7.59 15.89,6.96 16.44,6.96 Q3.3 18.13,6.9 C7.2
N$7
  Top 0.254: U3.3 15.02,7.09 15.33,6.79 15.33,5.74 15.66,5.41 Q3.4 16.5,5.4 16.5,4.4 16.91,3.99 C6.2
N$19
  Top 0.254: C5.2 Q1.1 32.26,19.88 32.09,20.04 29.3,20.04 28.82,19.56 28.82,16.74 28.51,16.44 U4.6
N$21
  Top 0.254: U4.4 29.71,15.14 C2.2
N$24
  Top 0.254: U4.2 28.52,13.84 28.92,13.44 28.92,13.11 29.58,12.45 C4.2
N$25
  Top 0.254: U4.5 30.15,15.79 C8.2 30.16,17.21 Q1.3
N$26
  Top 0.254: Q4.2 R4.2
N$27
  Top 0.3: U4.25 L2.1 C16.2 C17.2
N$28
  Top 0.3: U1.3 arc-90 32.35,2.67 C26.1
N$29
  Top 0.3: U4.27 L1.1 arc-90 L1.1
N$30
  Top 0.3: C26.2 R5.1
N$31
  Top 0.3: L1.2 L2.2 C18.2 C19.2
N$32
  Top 0.3: C19.1 L3.1
N$33
  Top 0.3: L3.2 C20.2 L4.1 C21.2
N$35
  Top 0.3: C21.1 L4.2 C22.2 32.84,4.47 arc-90 U1.1
N$36
  Top 0.3: U1.5 C23.2
N$37
  Top 0.406: U1.6 C28.2 34.74,7.74 Q4.1 R1.2
N$38
  Top 0.3: R5.2 C25.1
N$39
  Top 0.3: L5.2 C24.2 21.02,3.64 arc90 21.98,2.67 C25.2
N$40
  Top 0.3: U4.21 21.74,13.19 arc90 21.02,12.47 L5.1
N$41
  Top 0.254: R6.1 C27.1 arc90 C27.1 U1.4
N$42  (via drill 0.25)
  Top 0.254: U4.20 20.58,13.84 v20.21,13.47 | R6.2 v30.98,1.76 | R4.1 30.67,7.47 v30.95,7.19
  Bottom 0.254: v20.21,13.47 20.21,2.24 20.97,1.48 30.7,1.48 v30.98,1.76 30.98,7.17 v30.95,7.19
NSS  (via drill 0.25)
  Top 0.254: U4.19 20.24,14.49 v20,14.25 | U3.38 7.87,5.86 8.02,6 v8.62,6
  Bottom 0.254: v20,14.25 18.35,14.25 17.79,13.69 15.56,13.69 10.68,8.82 9.28,8.82 8.62,8.16 v8.62,6
PA0  (1 unrouted)
  Top 0.254: U3.10 15.12,10.59 15.61,11.08 15.61,17.02 14.36,18.27 1.26,18.27
PA1
  Top 0.254: U2.65 12.44,17.77 13.37,16.84 13.37,11.38 13.65,11.1 14.36,11.1 U3.11
PA2  (via drill 0.25)
  Top 0.254: U3.12 14.37,16.95 v14.39,16.97
  Route2 0.254: v6.95,19.31 6.97,19.31 6.97,19.36 7.35,19.74 13.73,19.74 14.39,19.08 v14.39,16.97
  Bottom 0.254: U2.70 6.66,19.02 v6.95,19.31
PA3  (via drill 0.25)
  Top 0.254: U3.13 12.87,16.46 v12.41,16.92
  Route2 0.254: v7.84,18.88 11.98,18.88 12.41,18.44 v12.41,16.92
  Bottom 0.254: U2.68 7.49,18.52 v7.84,18.88
PA4
  Top 0.254: U2.61 11.64,16.77 12.36,16.06 12.36,13.11 U3.14
PA8  (via drill 0.25)
  Top 0.254: v7.18,9.28 6.86,9.59 U3.29
  Route2 0.254: v7.18,9.28 7.18,7.62 6.8,7.24 3.34,7.24 3.11,7.01 v3.11,6.79
  Bottom 0.203: U2.20 2.47,6.53 2.48,6.53 2.66,6.53 2.91,6.79 v3.11,6.79
PA9  (via drill 0.25)
  Top 0.254: v3.82,9.38 3.9,9.45 4.74,9.45 5.1,9.09 U3.30
  Bottom 0.254: 3.67,9.53 v3.82,9.38 3.82,9.53 U2.32
PA10  (via drill 0.25)
  Top 0.254: 4.73,8.6 v4.59,8.74 4.73,8.59 U3.31
  Bottom 0.254: v4.59,8.74 4.59,7.88 4.05,7.34 2.86,7.34 2.53,7.01 1.51,7.01 U2.22
PA13  (via drill 0.25)
  Top 0.254: U3.34 4.82,7.09 4.82,7.1 4.71,6.99 v4.71,6.51
  Bottom 0.203: 4.38,6.48 4.41,6.51
  Bottom 0.254: 4.38,6.48 3.43,5.52 U2.16 | 4.41,6.51 v4.71,6.51
PA14  (via drill 0.25 pad 0.25)
  Top 0.254: U3.37 v7.37,3.46 v7.38,3.46
  Bottom 0.254: U2.6 6.95,3.02 v7.38,3.46
PB2  (1 unrouted)
  Top 0.254: U3.20 9.37,12.13 9.23,11.99 7.2,11.99 5.93,13.26 1.26,13.26
PB3  (via drill 0.25)
  Top 0.254: v7.79,2.8 8.37,3.38 U3.39
  Route15 0.254: v3.39,10.93 4.48,10.93 6.72,8.69 6.72,3.05 6.97,2.8 v7.79,2.8
  Bottom 0.254: 1.26,10.52 1.84,10.52 | 1.84,10.52 2.99,10.52 v3.39,10.93 | U2.36 1.84,10.53 1.84,10.52
PB4  (via drill 0.25)
  Top 0.254: v8.7,2.54 8.87,2.72 U3.40
  Route15 0.254: v8.7,2.54 8.32,2.16 6.8,2.16 6.03,2.93 6.03,8.26 4.13,10.16 v3.54,10.16
  Bottom 0.254: U2.34 1.8,10.03 1.84,9.99 3.37,9.99 v3.54,10.16
PB5  (via drill 0.25 pad 0.25)
  Top 0.254: U3.41 9.37,10.79 v9.23,10.93
  Bottom 0.254: U2.48 6.63,13.53 v9.23,10.93
PB6  (via drill 0.25)
  Top 0.254: U3.42 9.87,2.74 v10.3,2.32
  Route2 0.254: v4.56,16.21 4.56,14.1 5.45,13.21 8.9,13.21 9.87,12.25 9.87,2.75 v10.3,2.32
  Bottom 0.254: v4.56,16.21 4.24,16.52 U2.60
PB7  (via drill 0.25)
  Top 0.254: U3.43 10.37,3.41 v10.61,3.18
  Route2 0.254: v10.61,3.18 10.61,12.65 9.23,14.02 5.86,14.02 5.37,14.51 v5.37,15.47
  Bottom 0.254: 1.34,16.01 1.34,16.02 U2.58 3.45,16.02 4,15.47 v5.37,15.47
PB12  (via drill 0.25)
  Top 0.254: U3.25 5.83,11.63 v5.83,12.35
  Route2 0.254: v5.83,12.35 5.83,12.32 6.92,12.32 8.57,10.67 8.57,6.99 6.54,4.96 5.93,4.96 v5.32,4.35
  Bottom 0.254: U2.10 5,4.02 v5.32,4.35
PB13  (via drill 0.25)
  Top 0.254: U3.26 5.1,11.09 4.46,11.74 v4.46,12.12
  Bottom 0.254: U2.8 5.74,3.52 6.16,3.94 6.16,10.04 4.46,11.74 v4.46,12.12
PB14  (via drill 0.25)
  Top 0.254: U3.27 4.69,10.59 3.72,11.56 v3.72,11.66
  Bottom 0.254: U2.14 3.82,5.02 4.56,5.77 4.94,5.77 5.4,6.23 5.4,9.99 v3.72,11.66
PB15  (via drill 0.25)  (1 unrouted)
  Top 0.254: 7.83,10.1 7.83,10.09 U3.28
  Route2 0.254: v4.76,4.96 5.53,5.72 6.41,5.72 7.81,7.12 7.84,7.12 v7.84,10.09
  Bottom 0.254: v4.76,4.96 4.33,4.52 U2.12
RESET  (via drill 0.25)
  Top 0.254: U3.18 10.37,15.3 v10.35,15.32 | U4.7 v27.83,18.75
  Bottom 0.254: v10.35,15.32 10.35,17.17 10.83,17.66 15.74,17.66 16.37,18.29 16.37,18.32 17.97,19.92 27.52,19.92 27.83,19.61 v27.83,18.75
SCK  (via drill 0.25)
  Top 0.254: U3.15 11.85,13.12 11.85,14.41 v11.77,14.48 | v16.62,15.4 17.67,16.44 U4.16
  Bottom 0.254: v16.62,15.4 12.69,15.4 v11.77,14.48

### Text on the board
tPlace: E
bDocu: 433 | 470 | Frequency | 868 | 915 | 920-925 | LoRa ST v2.0